# EAGLE design AeroQuadMiniProto_v100 (EAGLE 5.11)
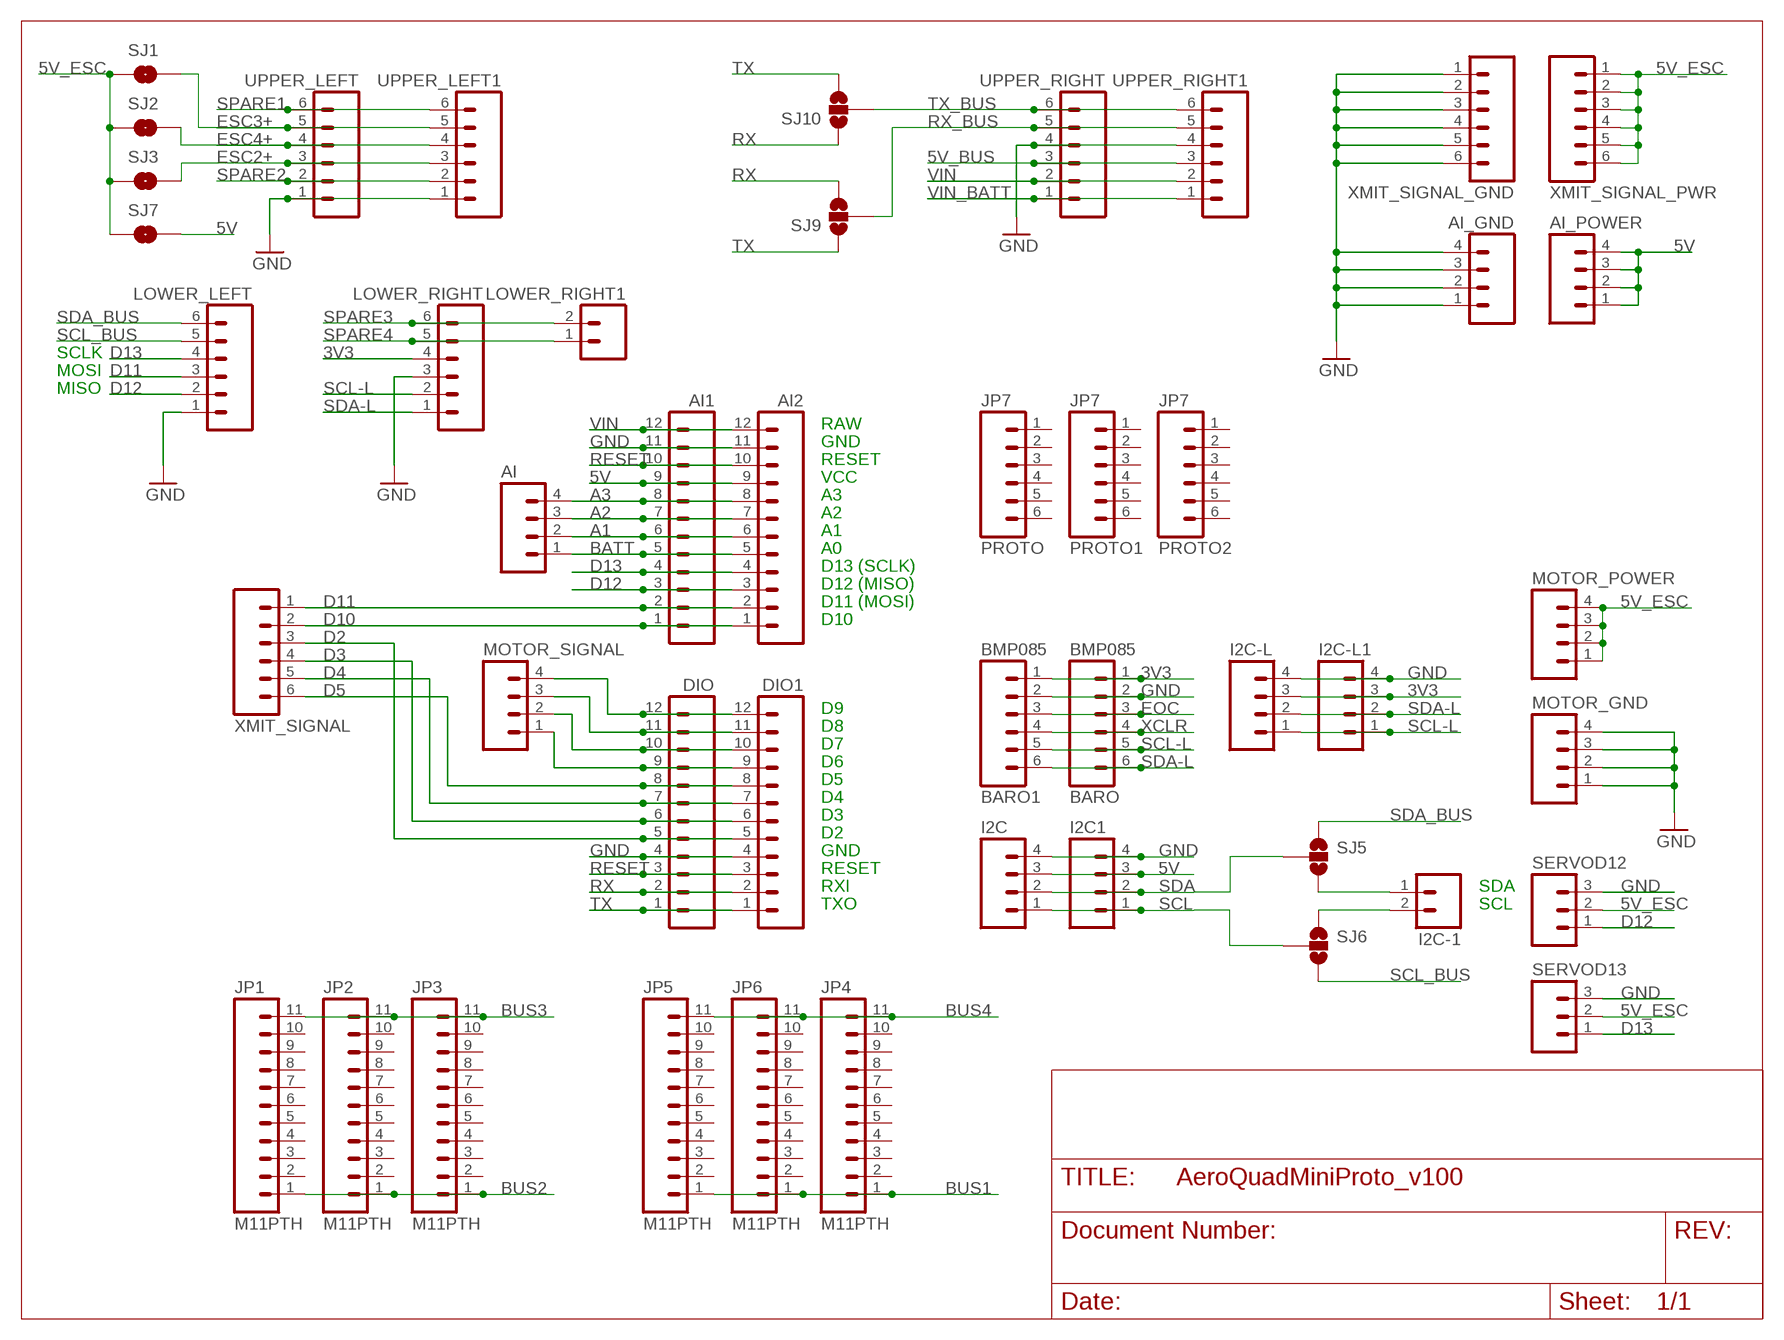
[diagram p0: schematic, sheet 1]

## Parts
AI  M04LOCK  [1X04_LOCK]
AI1  M12LOCK  [1X12_LOCK]
AI2  M12LOCK  [1X12_LOCK]
AI_GND  M04LOCK  [1X04_LOCK]
AI_POWER  M04LOCK  [1X04_LOCK]
BARO  BMP085  M06LOCK  [1X06_LOCK]
BARO1  BMP085  M06LOCK  [1X06_LOCK]
DIO  M12LOCK  [1X12_LOCK]
DIO1  M12LOCK  [1X12_LOCK]
I2C  M04LOCK  [1X04_LOCK]
I2C1  M04LOCK  [1X04_LOCK]
I2C-1  M02LOCK  [1X02_LOCK]
I2C-L  M04LOCK  [1X04_LOCK]
I2C-L1  M04LOCK  [1X04_LOCK]
JP1  M11PTH  [1X11]
JP2  M11PTH  [1X11]
JP3  M11PTH  [1X11]
JP4  M11PTH  [1X11]
JP5  M11PTH  [1X11]
JP6  M11PTH  [1X11]
LOWER_LEFT  M06LOCK  [1X06_LOCK]
LOWER_RIGHT  M06LOCK  [1X06_LOCK]
LOWER_RIGHT1  M02LOCK  [1X02_LOCK]
MOTOR_GND  M04LOCK  [1X04_LOCK]
MOTOR_POWER  M04LOCK  [1X04_LOCK]
MOTOR_SIGNAL  M04LOCK  [1X04_LOCK]
PROTO  JP7  M06LOCK  [1X06_LOCK]
PROTO1  JP7  M06LOCK  [1X06_LOCK]
PROTO2  JP7  M06LOCK  [1X06_LOCK]
SERVOD12  M03LOCK  [1X03_LOCK]
SERVOD13  M03LOCK  [1X03_LOCK]
SJ1  SOLDERJUMPERNO  [SJ_2S-NO]
SJ2  SOLDERJUMPERNO  [SJ_2S-NO]
SJ3  SOLDERJUMPERNO  [SJ_2S-NO]
SJ5  SOLDERJUMPER_2WAYS  [SJ_3]
SJ6  SOLDERJUMPER_2WAYS  [SJ_3]
SJ7  SOLDERJUMPERNO  [SJ_2S-NO]
SJ9  SOLDERJUMPER_2WAYS  [SJ_3]
SJ10  SOLDERJUMPER_2WAYS  [SJ_3]
UPPER_LEFT  M06LOCK  [1X06_LOCK]
UPPER_LEFT1  M06LOCK  [1X06_LOCK]
UPPER_RIGHT  M06LOCK  [1X06_LOCK]
UPPER_RIGHT1  M06LOCK  [1X06_LOCK]
XMIT_SIGNAL  M06LOCK  [1X06_LOCK]
XMIT_SIGNAL_GND  M06LOCK  [1X06_LOCK]
XMIT_SIGNAL_PWR  M06LOCK  [1X06_LOCK]

## Nets
3V3: BARO1.1 BARO.1 I2C-L1.3 I2C-L.3 LOWER_RIGHT.4
5V: AI1.9 AI2.9 AI_POWER.1 AI_POWER.2 AI_POWER.3 AI_POWER.4 I2C1.3 I2C.3 SJ7.2
5V_BUS: UPPER_RIGHT1.3 UPPER_RIGHT.3
5V_ESC: MOTOR_POWER.1 MOTOR_POWER.2 MOTOR_POWER.3 MOTOR_POWER.4 SERVOD12.2 SERVOD13.2 SJ1.1 SJ2.1 SJ3.1 SJ7.1 XMIT_SIGNAL_PWR.1 XMIT_SIGNAL_PWR.2 XMIT_SIGNAL_PWR.3 XMIT_SIGNAL_PWR.4 XMIT_SIGNAL_PWR.5 XMIT_SIGNAL_PWR.6
A1: AI1.6 AI2.6 AI.2
A2: AI1.7 AI2.7 AI.3
A3: AI1.8 AI2.8 AI.4
BATT: AI1.5 AI2.5 AI.1
BUS1: JP4.1 JP5.1 JP6.1
BUS2: JP1.1 JP2.1 JP3.1
BUS3: JP1.11 JP2.11 JP3.11
BUS4: JP4.11 JP5.11 JP6.11
D2: DIO1.5 DIO.5 XMIT_SIGNAL.3
D3: DIO1.6 DIO.6 XMIT_SIGNAL.4
D4: DIO1.7 DIO.7 XMIT_SIGNAL.5
D5: DIO1.8 DIO.8 XMIT_SIGNAL.6
D6: DIO1.9 DIO.9 MOTOR_SIGNAL.1
D7: DIO1.10 DIO.10 MOTOR_SIGNAL.2
D8: DIO1.11 DIO.11 MOTOR_SIGNAL.3
D9: DIO1.12 DIO.12 MOTOR_SIGNAL.4
D10: AI1.1 AI2.1 XMIT_SIGNAL.2
D11: AI1.2 AI2.2 LOWER_LEFT.3 XMIT_SIGNAL.1
D12: AI1.3 AI2.3 LOWER_LEFT.2 SERVOD12.1
D13: AI1.4 AI2.4 LOWER_LEFT.4 SERVOD13.1
EOC: BARO1.3 BARO.3
ESC2+: SJ3.2 UPPER_LEFT1.3 UPPER_LEFT.3
ESC3+: SJ1.2 UPPER_LEFT1.5 UPPER_LEFT.5
ESC4+: SJ2.2 UPPER_LEFT1.4 UPPER_LEFT.4
GND: AI1.11 AI2.11 AI_GND.1 AI_GND.2 AI_GND.3 AI_GND.4 BARO1.2 BARO.2 DIO1.4 DIO.4 I2C1.4 I2C-L1.4 I2C-L.4 I2C.4 LOWER_LEFT.1 LOWER_RIGHT.3 MOTOR_GND.1 MOTOR_GND.2 MOTOR_GND.3 MOTOR_GND.4 SERVOD12.3 SERVOD13.3 UPPER_LEFT1.1 UPPER_LEFT.1 UPPER_RIGHT1.4 UPPER_RIGHT.4 XMIT_SIGNAL_GND.1 XMIT_SIGNAL_GND.2 XMIT_SIGNAL_GND.3 XMIT_SIGNAL_GND.4 XMIT_SIGNAL_GND.5 XMIT_SIGNAL_GND.6
RESET: AI1.10 AI2.10 DIO1.3 DIO.3
RX: DIO1.2 DIO.2 SJ9.3 SJ10.1
RX_BUS: SJ9.2 UPPER_RIGHT1.5 UPPER_RIGHT.5
SCL: I2C1.1 I2C.1 SJ6.2
SCL-L: BARO1.5 BARO.5 I2C-L1.1 I2C-L.1 LOWER_RIGHT.2
SCL_BUS: LOWER_LEFT.5 SJ6.3
SCL_PROC: I2C-1.2 SJ6.1
SDA: I2C1.2 I2C.2 SJ5.2
SDA-L: BARO1.6 BARO.6 I2C-L1.2 I2C-L.2 LOWER_RIGHT.1
SDA_BUS: LOWER_LEFT.6 SJ5.1
SDA_PROC: I2C-1.1 SJ5.3
SPARE1: UPPER_LEFT1.6 UPPER_LEFT.6
SPARE2: UPPER_LEFT1.2 UPPER_LEFT.2
SPARE3: LOWER_RIGHT1.2 LOWER_RIGHT.6
SPARE4: LOWER_RIGHT1.1 LOWER_RIGHT.5
TX: DIO1.1 DIO.1 SJ9.1 SJ10.3
TX_BUS: SJ10.2 UPPER_RIGHT1.6 UPPER_RIGHT.6
VIN: AI1.12 AI2.12 UPPER_RIGHT1.2 UPPER_RIGHT.2
VIN_BATT: UPPER_RIGHT1.1 UPPER_RIGHT.1
XCLR: BARO1.4 BARO.4
Unconnected: JP1.2 JP1.3 JP1.4 JP1.5 JP1.6 JP1.7 JP1.8 JP1.9 JP1.10 JP2.2 JP2.3 JP2.4 JP2.5 JP2.6 JP2.7 JP2.8 JP2.9 JP2.10 JP3.2 JP3.3 JP3.4 JP3.5 JP3.6 JP3.7 JP3.8 JP3.9 JP3.10 JP4.2 JP4.3 JP4.4 JP4.5 JP4.6 JP4.7 JP4.8 JP4.9 JP4.10 JP5.2 JP5.3 JP5.4 JP5.5 JP5.6 JP5.7 JP5.8 JP5.9 JP5.10 JP6.2 JP6.3 JP6.4 JP6.5 JP6.6 JP6.7 JP6.8 JP6.9 JP6.10 PROTO1.1 PROTO1.2 PROTO1.3 PROTO1.4 PROTO1.5 PROTO1.6 PROTO2.1 PROTO2.2 PROTO2.3 PROTO2.4 PROTO2.5 PROTO2.6 PROTO.1 PROTO.2 PROTO.3 PROTO.4 PROTO.5 PROTO.6

## Notes on the sheet
- SCLK
- MOSI
- MISO
- RAW
- GND
- RESET
- VCC
- A3
- A2
- A1
- A0
- D13 (SCLK)
- D12 (MISO)
- D11 (MOSI)
- D10
- D9
- D8
- D7
- D6
- D5
- D4
- D3
- D2
- GND
- RESET
- RXI | SDA
- TXO | SCL

## Library data of the parts
AI AI_GND AI_POWER I2C I2C1 I2C-L I2C-L1 MOTOR_GND MOTOR_POWER MOTOR_SIGNAL = SparkFun:M04: Header 4 Standard 4-pin 0.1" header. Use with straight break away headers (SKU : PRT-00116), right angle break away headers (PRT-00553), swiss pins (PRT-00743), machine pins (PRT-00117), and female headers (PRT-00115). Molex polarized connector foot print use with SKU : PRT-08231 with associated crimp pins and housings. 1MM SMD Version SKU: PRT-10208
AI1 AI2 DIO DIO1 = SparkFun:M12: Header 12 Standard 12-pin 0.1" header. Use with straight break away headers (SKU : PRT-00116), right angle break away headers (PRT-00553), swiss pins (PRT-00743), machine pins (PRT-00117), and female headers (PRT-00115).
BARO BARO1 LOWER_LEFT LOWER_RIGHT PROTO PROTO1 PROTO2 UPPER_LEFT UPPER_LEFT1 UPPER_RIGHT UPPER_RIGHT1 XMIT_SIGNAL XMIT_SIGNAL_GND XMIT_SIGNAL_PWR = SparkFun:M06: Header 6 Standard 6-pin 0.1" header. Use with straight break away headers (SKU : PRT-00116), right angle break away headers (PRT-00553), swiss pins (PRT-00743), machine pins (PRT-00117), and female headers (PRT-00115). Molex polarized connector foot print use with SKU : PRT-08094 with associated crimp pins and housings. NOTES ON THE VARIANTS LOCK and LOCK_LONGPADS... This footprint was designed to help hold the alignment of a through-hole component (i.e. 6-pin header) while soldering it into place. You may notice that each hole has been shifted either up or down by 0.005 of an inch from it's more standard position (which is a perfectly straight line). This slight alteration caused the pins (the squares in the middle) to touch the edges of the holes. Because they are alternating, it causes a "brace" to hold the component in place. 0.005 has proven to be the perfect amount of "off-center" position when using our standard breakaway headers. Although looks a little odd when you look at the bare footprint, once you have a header in there, the alteration is very hard to notice. Also, if you push a header all the way into place, it is covered up entirely on the bottom side. This idea of altering the position of holes to aid alignment will be further integrated into the Sparkfun Library for other footprints. It can help hold any component with 3 or more connection pins.
I2C-1 LOWER_RIGHT1 = SparkFun:M02: Header 2 Standard 2-pin 0.1" header. Use with straight break away headers (SKU : PRT-00116), right angle break away headers (PRT-00553), swiss pins (PRT-00743), machine pins (PRT-00117), and female headers (PRT-00115). Molex polarized connector foot print use with SKU : PRT-08233 with associated crimp pins and housings.
JP1-JP6 = SparkFun:M11: Header 11 Standard 11-pin 0.1" header. Use with straight break away headers (SKU : PRT-00116), right angle break away headers (PRT-00553), swiss pins (PRT-00743), machine pins (PRT-00117), and female headers (PRT-00115).
SERVOD12 SERVOD13 = SparkFun:M03: Header 3 Standard 3-pin 0.1" header. Use with straight break away headers (SKU : PRT-00116), right angle break away headers (PRT-00553), swiss pins (PRT-00743), machine pins (PRT-00117), and female headers (PRT-00115). Molex polarized connector foot print use with SKU : PRT-08232 with associated crimp pins and housings.
SJ1-SJ3 SJ7 = SparkFun:SOLDERJUMPER: Solder Jumper Standard SMD solder jumper. Used to automate production. Two varients : Normally Open and Normally Closed are the same, but have different paste layers. NC will have a large amount of paste and should jumper during reflow.
SJ5 SJ6 SJ9 SJ10 = SparkFun:SOLDERJUMPER_2WAY: Solder Jumper 2 way solder jumper

## Net classes
1 power: width 0.381 mm, clearance 0.254 mm

## Board
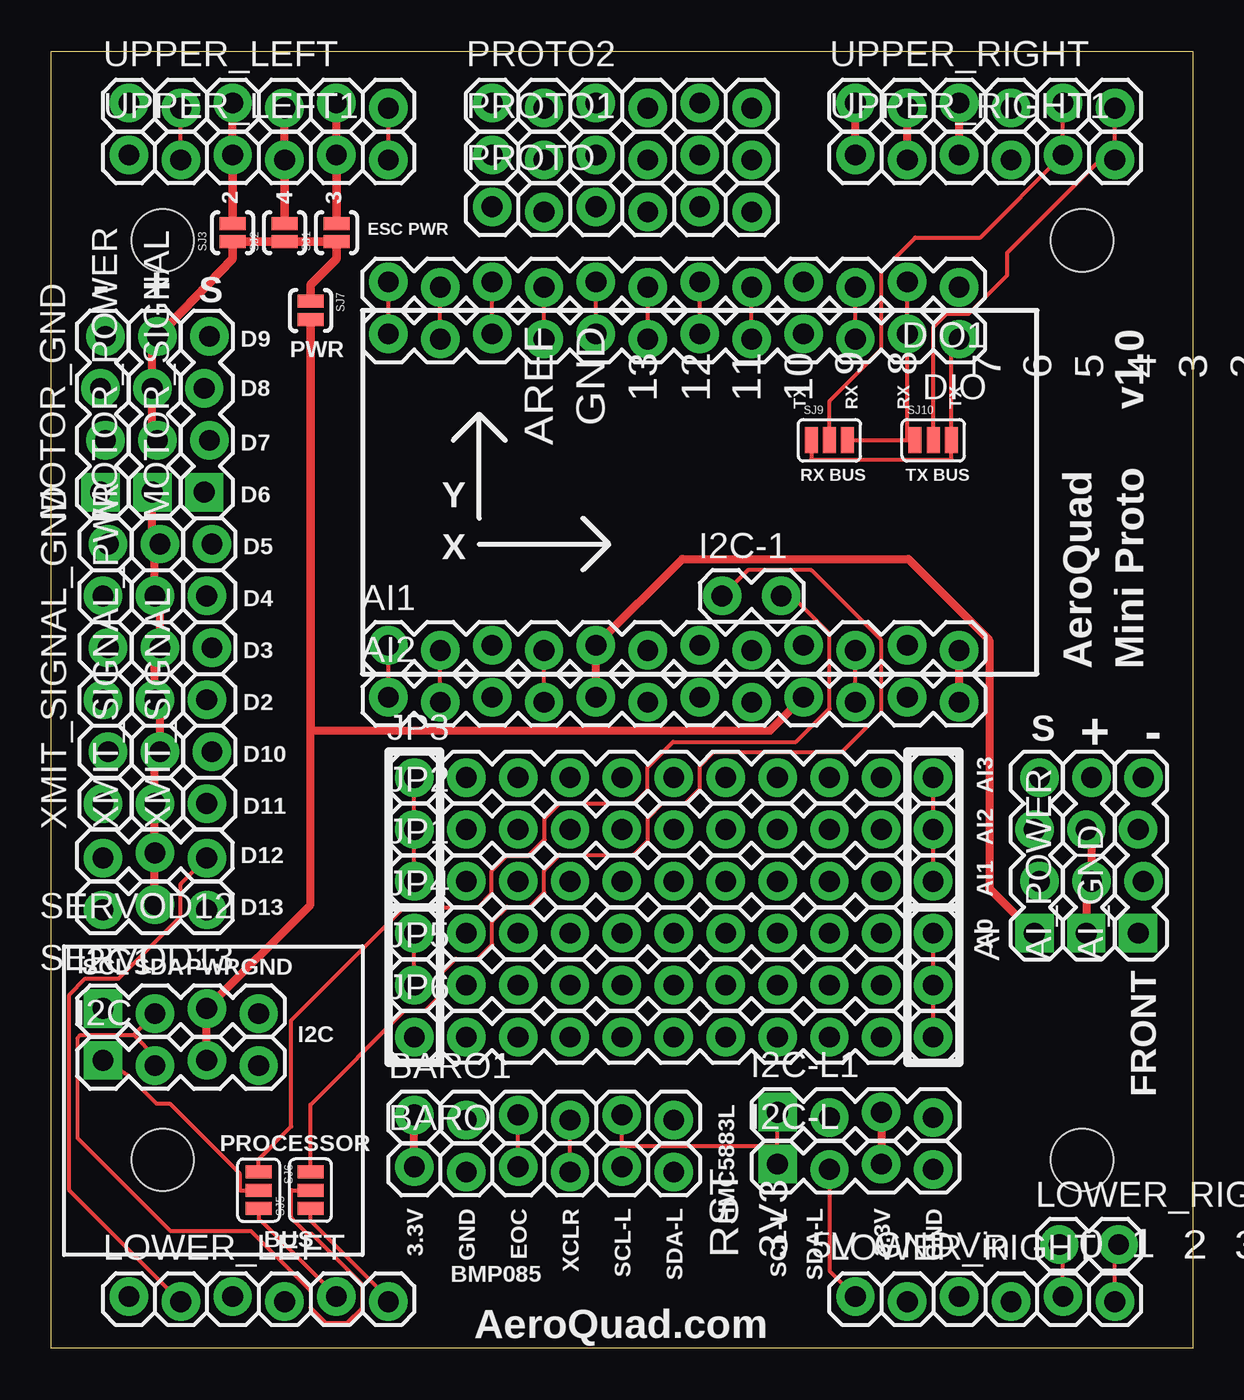
[diagram p1: board, top side]
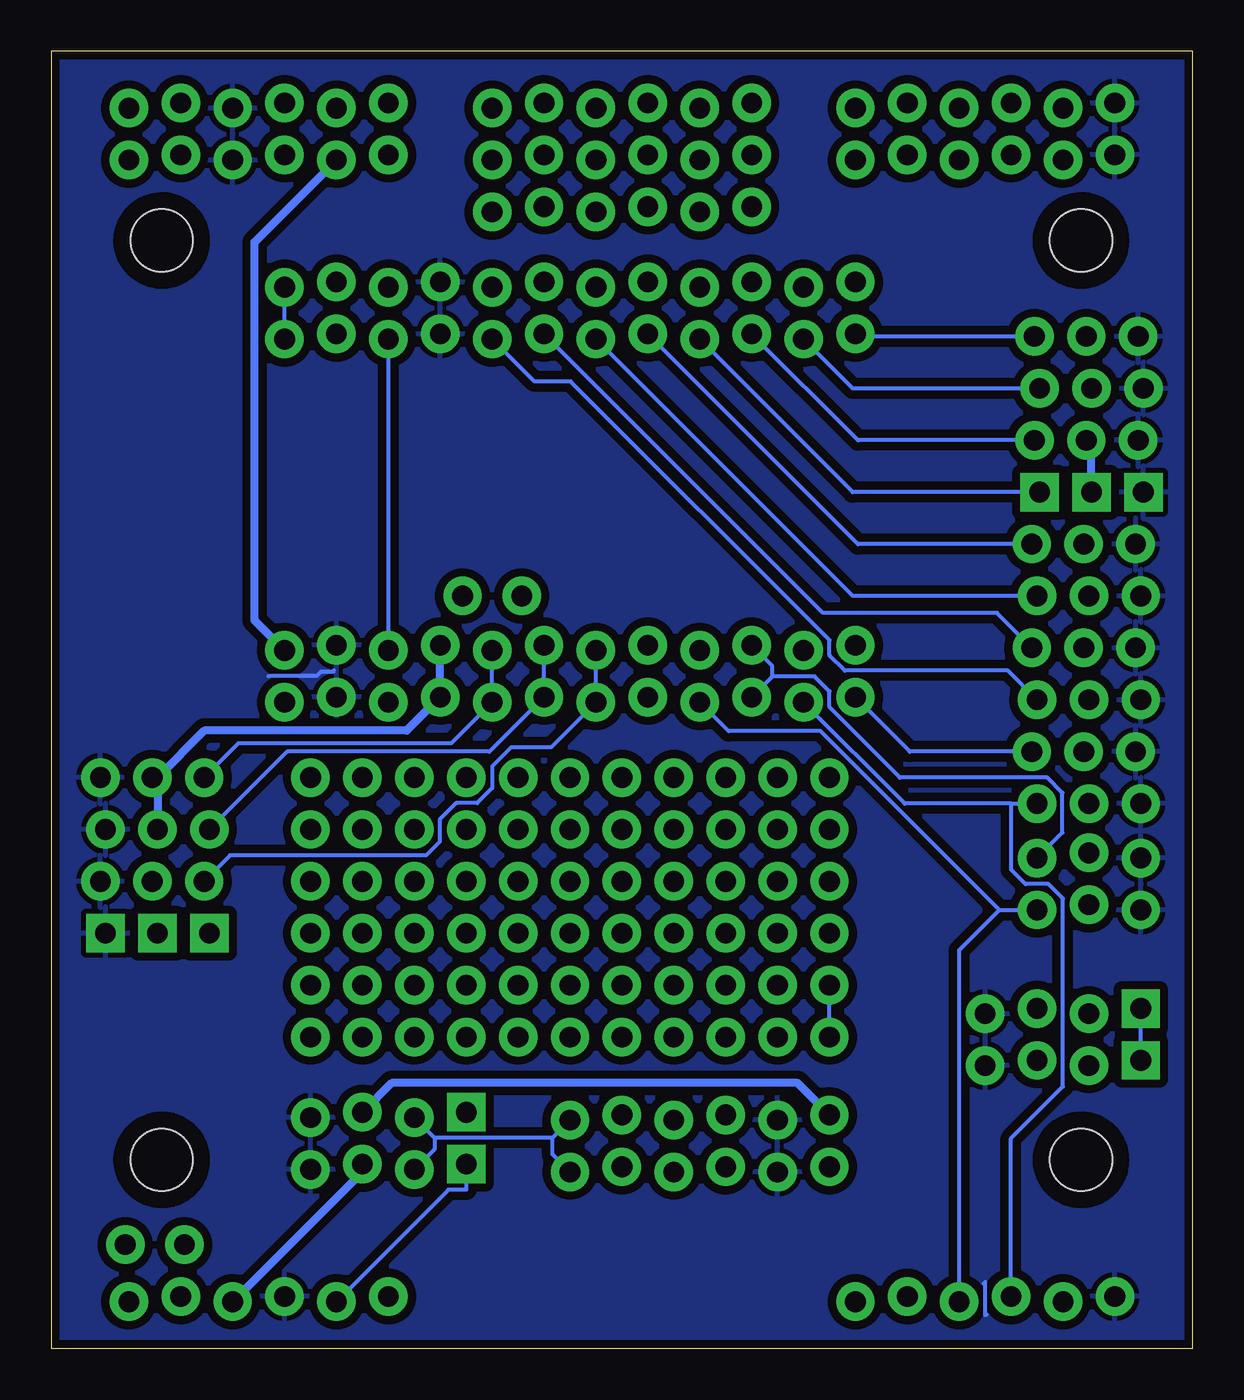
[diagram p2: board, bottom side, seen from below]

Size 55.88 x 63.5 mm. Coordinates in mm from the lower left corner, seen from the top.
Outline: 0,63.5 55.88,63.5 55.88,0 0,0 0,63.5
Copper layers (1*16): Top 0.035mm / dielectric 1.5mm / Bottom 0.035mm
Design rules "SparkFun": minimum track width 8mil, minimum drill 20mil, track to track 8mil, track to pad 8mil, pad to pad 8mil, via to via 8mil, smd to smd 8mil, copper to edge 10mil, drill to drill 8mil, minimum pad ring 12mil, minimum via ring 10mil, stop-mask expansion 4mil, vias tented up to drill 25mil, thermal gap 10mil

### Footprints (pad centres in the part's own frame; a part is rotated, then mirrored left to right if it is on the bottom)
1X04_LOCK = drill 1.016 pad 1.88 square: 1 0,0.127 | drill 1.016 pad 1.88 round: 2 2.54,-0.127; 3 5.08,0.127; 4 7.62,-0.127
1X12_LOCK = drill 1.016 pad 1.88 round: 1 0,0.127; 2 2.54,-0.127; 3 5.08,0.127; 4 7.62,-0.127; 5 10.16,0.127; 6 12.7,-0.127; 7 15.24,0.127; 8 17.78,-0.127; 9 20.32,0.127; 10 22.86,-0.127; 11 25.4,0.127; 12 27.94,-0.127
1X06_LOCK = drill 1.016 pad 1.88 round: 1 0,0; 2 2.54,-0.254; 3 5.08,0; 4 7.62,-0.254; 5 10.16,0; 6 12.7,-0.254
1X02_LOCK = drill 1.016 pad 1.88 round: 1 -0.178,0; 2 2.718,0
1X11 = drill 1.016 pad 1.88 round: 1 0,0; 2 2.54,0; 3 5.08,0; 4 7.62,0; 5 10.16,0; 6 12.7,0; 7 15.24,0; 8 17.78,0; 9 20.32,0; 10 22.86,0; 11 25.4,0
1X03_LOCK = drill 1.016 pad 1.88 round: 1 0,0.127; 2 2.54,-0.127; 3 5.08,0.127
SJ_2S-NO = smd 0.635 x 1.27: 1 -0.45,0; 2 0.45,0
SJ_3 = smd 0.635 x 1.27: 1 -0.889,0; 2 0,0; 3 0.889,0
STAND-OFF-TIGHT = hole 3.048: 0,0

### Placement (x,y rotation side)
AI  48.26,20.32 90 top
AI1  16.51,34.29 0 top
AI2  16.51,31.75 0 top
AI_GND  53.34,20.32 90 top
AI_POWER  50.8,20.32 90 top
BARO  17.78,8.89 0 top
BARO1  17.78,11.43 0 top
DIO  44.45,49.53 180 top
DIO1  44.45,52.07 180 top
I2C  2.54,13.97 0 top
I2C1  2.54,16.51 0 top
I2C-1  33.02,36.83 0 top
I2C-L  35.56,8.89 0 top
I2C-L1  35.56,11.43 0 top
JP1  17.78,22.86 0 top
JP2  17.78,25.4 0 top
JP3  17.78,27.94 0 top
JP4  17.78,20.32 0 top
JP5  17.78,17.78 0 top
JP6  17.78,15.24 0 top
LOWER_LEFT  3.81,2.54 0 top
LOWER_RIGHT  39.37,2.54 0 top
LOWER_RIGHT1  49.53,5.08 0 top
MOTOR_GND  2.54,41.91 90 top
MOTOR_POWER  5.08,41.91 90 top
MOTOR_SIGNAL  7.62,41.91 90 top
PROTO  21.59,55.88 0 top
PROTO1  21.59,58.42 0 top
PROTO2  21.59,60.96 0 top
SERVOD12  7.62,24.13 180 top
SERVOD13  7.62,21.59 180 top
SJ1  13.97,54.61 90 top
SJ2  11.43,54.61 90 top
SJ3  8.89,54.61 90 top
SJ5  12.7,7.75 90 top
SJ6  10.16,7.75 270 top
SJ7  12.7,50.8 270 top
SJ9  38.1,44.45 0 top
SJ10  43.18,44.45 0 top
U$1  [STAND-OFF-TIGHT]  5.46,9.23 0 top
U$2  [STAND-OFF-TIGHT]  50.46,9.23 0 top
U$3  [STAND-OFF-TIGHT]  50.46,54.23 0 top
U$5  [STAND-OFF-TIGHT]  5.46,54.23 0 top
UPPER_LEFT  3.81,60.96 0 top
UPPER_LEFT1  3.81,58.42 0 top
UPPER_RIGHT  39.37,60.96 0 top
UPPER_RIGHT1  39.37,58.42 0 top
XMIT_SIGNAL  7.62,26.67 90 top
XMIT_SIGNAL_GND  2.54,26.67 90 top
XMIT_SIGNAL_PWR  5.08,26.67 90 top

### Tracks (layer width: path | path; a pad name or v marks a point on that pad's centre or on a via)
3V3
  Top 0.381: BARO.1 BARO1.1 | I2C-L1.3 I2C-L.3
  Bottom 0.381: I2C-L1.3 39.21,12.99 19.34,12.99 BARO1.1 | LOWER_RIGHT.4 40.64,8.64 I2C-L.3
5V
  Top 0.381: AI2.9 35.19,30.23 12.7,30.23 12.7,21.72 I2C1.3 I2C.3 | AI_POWER.1 50.67,22.61 AI_POWER.2 50.93,25.15 AI_POWER.3
  Top 0.406: 12.7,30.23 SJ7.2
  Bottom 0.381: 50.67,27.94 AI_POWER.3 | 50.67,27.94 48.38,30.23 38.47,30.23 AI2.9 AI1.9 | 50.67,27.94 AI_POWER.4
5V_BUS
  Top 0.381: UPPER_RIGHT1.3 UPPER_RIGHT.3
5V_ESC
  Top 0.381: MOTOR_POWER.2 4.95,44.7 MOTOR_POWER.3 4.95,49.28 MOTOR_POWER.4 | SERVOD13.2 SERVOD12.2 XMIT_SIGNAL_PWR.1 5.08,28.96 XMIT_SIGNAL_PWR.2 5.33,31.5 XMIT_SIGNAL_PWR.3 5.08,34.04 XMIT_SIGNAL_PWR.4 5.33,36.58 XMIT_SIGNAL_PWR.5 5.08,39.12 XMIT_SIGNAL_PWR.6 4.95,39.75 MOTOR_POWER.1
  Top 0.406: MOTOR_POWER.4 8.89,53.34 SJ3.1 SJ2.1 SJ1.1 13.97,53.34 12.7,52.07 SJ7.1
  Bottom 0.381: MOTOR_POWER.2 4.95,44.2 MOTOR_POWER.1
A1
  Bottom 0.203: AI.2 47.12,24.13 37.52,24.13 36.85,24.79 36.85,25.89 36.05,26.7 35.02,26.7 34.29,27.42 34.29,28.48 33.35,29.42 31.41,29.42 AI2.6 AI1.6
A2
  Bottom 0.203: AI.3 44.32,29.21 34.42,29.21 AI2.7 AI1.7
A3
  Bottom 0.203: AI.4 46.71,29.62 36.3,29.62 AI2.8 AI1.8
BATT
  Top 0.381: AI.1 45.93,22.53 45.93,34.67 41.95,38.64 30.9,38.64 AI1.5 AI2.5
BUS1
  Top 0.203: JP5.1 JP4.1
  Bottom 0.203: JP6.1 JP5.1
BUS2
  Top 0.203: JP1.1 JP2.1 JP3.1
BUS3
  Top 0.203: JP1.11 JP2.11 JP3.11
BUS4
  Top 0.203: JP4.11 JP5.11 JP6.11
D2
  Top 0.203: DIO.5 DIO1.5
  Bottom 0.203: XMIT_SIGNAL.3 9.04,33.17 17.04,33.17 17.78,33.92 17.78,34.66 30.44,47.33 32.22,47.33 DIO.5
D3
  Top 0.203: DIO.6 DIO1.6
  Bottom 0.203: XMIT_SIGNAL.4 9.59,36 18.09,36 DIO.6
D4
  Top 0.203: DIO.7 DIO1.7
  Bottom 0.203: XMIT_SIGNAL.5 16.64,36.83 DIO.7
D5
  Top 0.203: DIO.8 DIO1.8
  Bottom 0.203: XMIT_SIGNAL.6 16.38,39.37 DIO.8
D6
  Top 0.203: DIO.9 DIO1.9
  Bottom 0.203: MOTOR_SIGNAL.1 16.64,41.91 DIO.9
D7
  Top 0.203: DIO.10 DIO1.10
  Bottom 0.203: MOTOR_SIGNAL.2 16.38,44.45 DIO.10
D8
  Top 0.203: DIO.11 DIO1.11
  Bottom 0.203: MOTOR_SIGNAL.3 16.64,46.99 DIO.11
D9
  Top 0.203: DIO.12 DIO1.12
  Bottom 0.203: MOTOR_SIGNAL.4 16.38,49.53 DIO.12
D10
  Top 0.203: AI2.1 AI1.1
  Bottom 0.203: XMIT_SIGNAL.2 13.84,29.21 AI2.1
D11
  Top 0.203: AI2.2 AI1.2
  Bottom 0.203: 8.88,26.67 14.1,26.67 AI2.2 | 8.88,26.67 XMIT_SIGNAL.1 | 8.88,26.67 8.88,23.43 8.19,22.73 7.06,22.73 6.35,22.02 6.35,12.82 8.89,10.28 LOWER_LEFT.3
D12
  Top 0.203: SERVOD12.1 6.35,22.73 6.35,21.15 3.31,18.11 1.68,18.11 0.89,17.32 0.89,7.75 LOWER_LEFT.2
  Bottom 0.203: 20.57,32.89 AI2.3 | SERVOD12.1 6.38,25.25 6.38,27.2 7.12,27.94 14.33,27.94 17.78,31.39 17.78,32.16 18.51,32.89 20.57,32.89 | 20.57,32.89 20.57,33.4 AI1.3
D13
  Top 0.203: AI2.4 AI1.4
  Bottom 0.203: 9.46,21.46 18.22,30.21 22.72,30.21 AI2.4 | 9.46,21.46 SERVOD13.1 | LOWER_LEFT.4 11.43,19.5 9.46,21.46
EOC
  Top 0.203: BARO.3 BARO1.3
ESC2+
  Top 0.381: UPPER_LEFT1.3 UPPER_LEFT.3
  Top 0.406: SJ3.2 UPPER_LEFT1.3
ESC3+
  Top 0.381: UPPER_LEFT1.5 UPPER_LEFT.5
  Top 0.406: SJ1.2 UPPER_LEFT1.5
ESC4+
  Top 0.381: UPPER_LEFT1.4 UPPER_LEFT.4
  Top 0.406: SJ2.2 UPPER_LEFT1.4
GND
  Bottom 0.203: 10.24,3.17 10.16,3.25 10.16,1.63 10.09,1.66 | 42.04,33.19 42.06,33.12 42.67,33.12 42.88,32.92 45.11,32.92 45.23,32.89
  pour Bottom (isolate 0.406): 0,63.5 55.88,63.5 55.88,0 0,0
RESET
  Top 0.203: AI2.10 AI1.10 | DIO.3 DIO1.3
  Bottom 0.203: AI1.10 DIO.3
RX
  Top 0.203: SJ9.3 41.91,44.45 | 41.91,44.45 SJ10.1 | 41.91,44.45 DIO.2 DIO1.2
RX_BUS
  Top 0.203: SJ9.2 38.1,46.37 40.64,48.91 40.64,52.71 42.3,54.37 45.48,54.37 UPPER_RIGHT1.5 UPPER_RIGHT.5
SCL
  Top 0.203: SJ6.2 9.22,7.75 9.22,8.57 5.79,11.99 5.15,11.99 3.79,13.36 I2C.1
  Bottom 0.203: I2C.1 I2C1.1
SCL-L
  Top 0.203: BARO.5 27.94,9.91 | 27.94,9.91 BARO1.5 | 27.94,9.91 35.56,9.91 | 35.56,9.91 I2C-L.1 | 35.56,9.91 I2C-L1.1
  Bottom 0.203: I2C-L.1 35.56,7.77 36.42,7.77 LOWER_RIGHT.2
SCL_BUS
  Top 0.203: SJ6.3 10.16,6.24 10.27,6.24 LOWER_LEFT.5
SCL_PROC
  Top 0.203: SJ6.1 10.16,9.26 11.76,10.86 11.76,16.07 17.28,21.59 20.9,21.59 21.57,22.26 21.57,23.37 22.3,24.11 23.35,24.11 24.16,24.91 24.16,25.94 24.89,26.67 28.52,26.67 29.18,27.33 29.18,28.43 30.44,29.69 36.47,29.69 38.1,31.32 38.1,34.99 36.26,36.83 I2C-1.2
SDA
  Top 0.203: 4.04,15.34 1.44,15.34 1.29,15.2 1.29,10.29 5.84,5.75 9.77,5.75 12.7,2.82 12.7,2 13.45,1.25 14.49,1.25 15.24,2 15.24,3.12 12.74,5.62 12.54,5.62 11.76,6.39 11.76,7.75 SJ5.2 | 4.04,15.34 5.08,14.3 I2C.2 | 4.04,15.34 I2C1.2
SDA-L
  Top 0.203: LOWER_RIGHT.1 38.1,3.81 I2C-L.2
  Bottom 0.203: 31.34,10.31 37.11,10.31 | 37.11,10.31 I2C-L1.2 | I2C-L.2 37.11,9.75 37.11,10.31 | 31.34,10.31 BARO1.6 | 31.34,10.31 31.34,9.5 BARO.6
SDA_BUS
  Top 0.203: SJ5.1 12.7,6.24 16.51,2.43 LOWER_LEFT.6
SDA_PROC
  Top 0.203: SJ5.3 12.7,11.93 17.3,16.54 18.34,16.54 19.07,17.27 19.07,18.34 19.81,19.07 20.88,19.07 21.59,19.78 21.59,20.89 22.31,21.61 23.42,21.61 24.13,22.32 24.13,23.39 24.89,24.16 28.5,24.16 29.21,24.86 29.21,25.97 29.93,26.7 31.04,26.7 31.75,27.4 31.75,28.52 32.42,29.18 38.71,29.18 40.64,31.11 40.64,34.67 37.22,38.1 34.11,38.1 I2C-1.1
SPARE1
  Top 0.203: UPPER_LEFT1.6 UPPER_LEFT.6
SPARE2
  Top 0.203: UPPER_LEFT1.2 UPPER_LEFT.2
SPARE3
  Top 0.203: LOWER_RIGHT1.2 52.07,4.9 LOWER_RIGHT.6
SPARE4
  Top 0.203: LOWER_RIGHT1.1 49.53,4.9 LOWER_RIGHT.5
TX
  Top 0.203: SJ9.1 37.21,43.51 44.07,43.51 SJ10.3 44.07,49.02 DIO.1
  Bottom 0.203: DIO.1 DIO1.1
TX_BUS
  Top 0.203: SJ10.2 43.18,49.98 43.85,50.65 44.92,50.65 46.81,52.54 46.81,53.63 51.34,58.17 UPPER_RIGHT1.6 UPPER_RIGHT.6
VIN
  Top 0.381: AI2.12 AI1.12 | UPPER_RIGHT1.2 UPPER_RIGHT.2
  Bottom 0.381: UPPER_RIGHT1.2 45.92,54.15 45.92,35.64 AI1.12
VIN_BATT
  Top 0.381: UPPER_RIGHT1.1 UPPER_RIGHT.1
XCLR
  Top 0.203: BARO.4 BARO1.4

### Text on the board
tPlace: 2 | 4 | 3 | ESC PWR | - | + | S | D9 | PWR | D8 | TX | RX | RX | TX | v1.0 | D7 | RX BUS | TX BUS | Y | D6 | X | D5 | D4 | D3 | AeroQuad | Mini Proto | D2 | S | + | - | D10 | AI3 | D11 | AI2 | D12 | AI1 | D13 | A0 | SCL | SDA | PWR | GND | I2C | HMC5883L | FRONT | PROCESSOR | 3.3V | GND | EOC | XCLR | SCL-L | SDA-L | SCL-L | SDA-L | 3.3V | GND | BUS | BMP085 | AeroQuad.com
tNames: 9 | 8 | 7 | 6 | 5 | 4 | 3 | 2 | 1 | 0 | 13 | 12 | 11 | 10 | GND | AREF | RST | 3V3 | 5V | GND | Vin | 0 | 1 | 2 | 3 | 4 | 5